# Altium schematic sheet usb_usb2534.SchDoc
size B
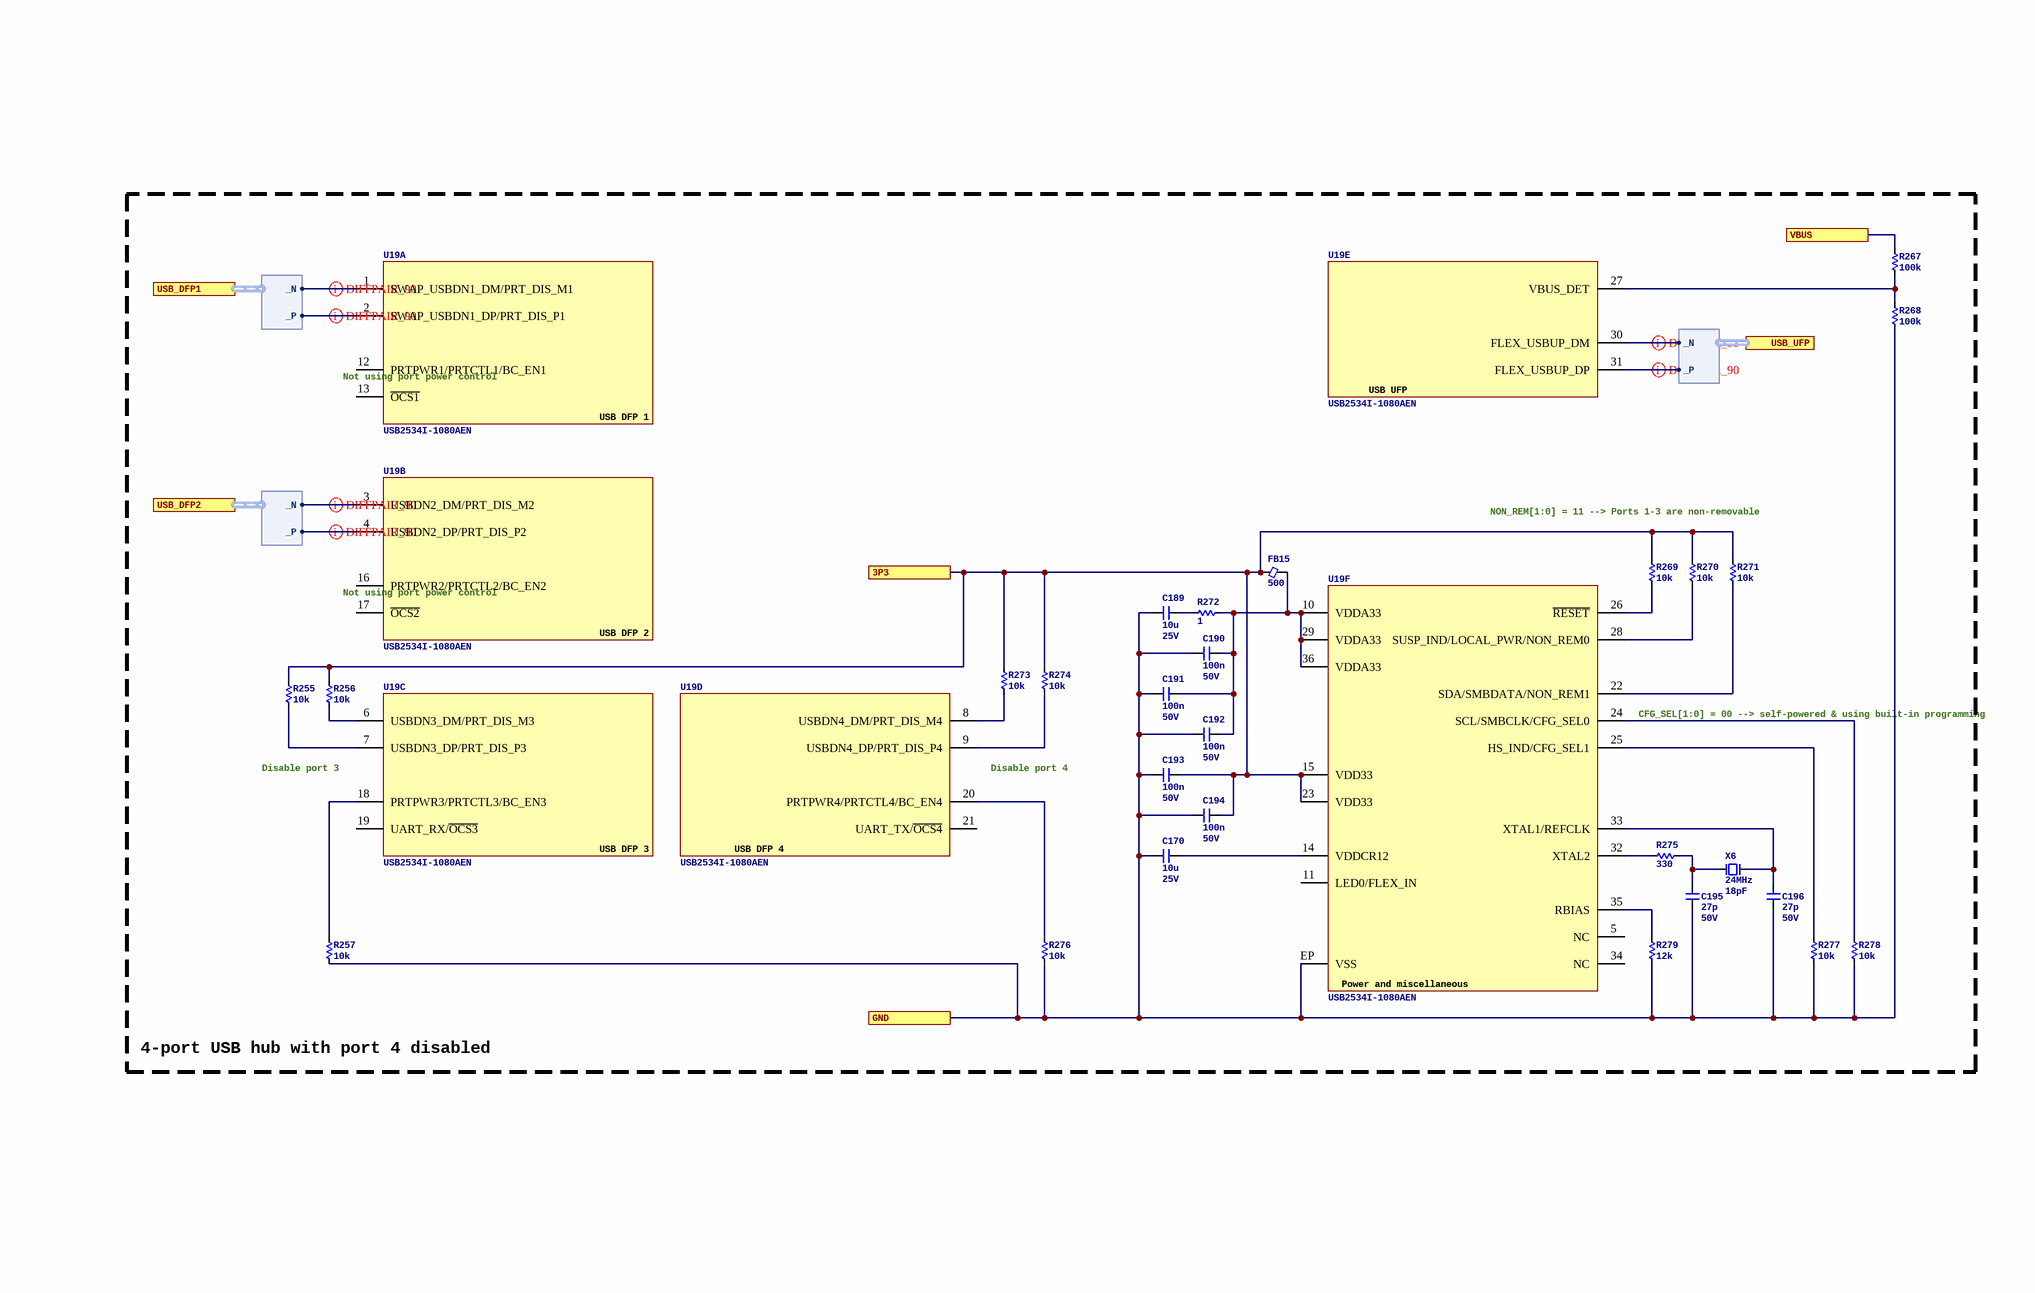
[diagram p0: usb_usb2534.SchDoc]

## Parts
C170  Capacitance: 10u  Voltage Rating: 25V  [C0603]  (hidden comment: CL10A106MA8NRNC)
C189  Capacitance: 10u  Voltage Rating: 25V  [C0805]  (hidden comment: CL21B106KAYQNNE)
C190  Capacitance: 100n  Voltage Rating: 50V  [C0402]  (hidden comment: CL05B104KB54PNC)
C191  Capacitance: 100n  Voltage Rating: 50V  [C0402]  (hidden comment: CL05B104KB54PNC)
C192  Capacitance: 100n  Voltage Rating: 50V  [C0402]  (hidden comment: CL05B104KB54PNC)
C193  Capacitance: 100n  Voltage Rating: 50V  [C0402]  (hidden comment: CL05B104KB54PNC)
C194  Capacitance: 100n  Voltage Rating: 50V  [C0402]  (hidden comment: CL05B104KB54PNC)
C195  Capacitance: 27p  Voltage Rating: 50V  [C0402]  (hidden comment: 0402CG270J500NT)
C196  Capacitance: 27p  Voltage Rating: 50V  [C0402]  (hidden comment: 0402CG270J500NT)
FB15  Current Rating (mA): 500  [FB0402]  (hidden comment: BLM15AX601SN1D)
R255  value 10k  [R0402]  (hidden comment: 0402WGF1002TCE)
R256  value 10k  [R0402]  (hidden comment: 0402WGF1002TCE)
R257  value 10k  [R0402]  (hidden comment: 0402WGF1002TCE)
R267  value 100k  [R0402]  (hidden comment: 0402WGF1003TCE)
R268  value 100k  [R0402]  (hidden comment: 0402WGF1003TCE)
R269  value 10k  [R0402]  (hidden comment: 0402WGF1002TCE)
R270  value 10k  [R0402]  (hidden comment: 0402WGF1002TCE)
R271  value 10k  [R0402]  (hidden comment: 0402WGF1002TCE)
R272  value 1  [R0402]  (hidden comment: CRCW04021R00FKED)
R273  value 10k  [R0402]  (hidden comment: 0402WGF1002TCE)
R274  value 10k  [R0402]  (hidden comment: 0402WGF1002TCE)
R275  value 330  [R0402]  (hidden comment: 0402WGF3300TCE)
R276  value 10k  [R0402]  (hidden comment: 0402WGF1002TCE)
R277  value 10k  [R0402]  (hidden comment: 0402WGF1002TCE)
R278  value 10k  [R0402]  (hidden comment: 0402WGF1002TCE)
R279  value 12k  [R0402]  (hidden comment: 0402WGF1202TCE)
U19  USB2534I-1080AEN  [QFN50P600X600X90-36N]  (parts A,B,C,D,E,F of 6)
X6  Frequency: 24MHz  Load Capacitance: 18pF  [XTAL_TXC_7A]  (hidden comment: 7A-24.000MAAJ-T)

## Ports
3P3, GND, USB_DFP1 (harness DIFF), USB_DFP2 (harness DIFF), USB_UFP (harness DIFF), VBUS

## Harnesses
DIFF: _N, _P

## Nets
3P3: C193.1 C194.1 FB15.1 R255.1 R256.1 R269.1 R270.1 R271.1 R273.1 R274.1 U19.15(VDD33) U19.23(VDD33) ; port 3P3
GND: C170.2 C189.2 C190.2 C191.2 C192.2 C193.2 C194.2 C195.2 C196.2 R257.2 R268.1 R276.2 R277.2 R278.2 R279.2 U19.EP(VSS) ; port GND
VBUS: R267.1 ; port VBUS
NetC170_1: C170.1 U19.14(VDDCR12)
NetC189_1: C189.1 R272.2
NetC190_1: C190.1 C191.1 C192.1 FB15.2 R272.1 U19.10(VDDA33) U19.29(VDDA33) U19.36(VDDA33)
NetC195_1: C195.1 R275.1 X6.1
NetC196_1: C196.1 U19.33(XTAL1/REFCLK) X6.2
NetR255_2: R255.2 U19.7(USBDN3_DP/PRT_DIS_P3)
NetR256_2: R256.2 U19.6(USBDN3_DM/PRT_DIS_M3)
NetR257_1: R257.1 U19.18(PRTPWR3/PRTCTL3/BC_EN3)
NetR267_2: R267.2 R268.2 U19.27(VBUS_DET)
NetR269_2: R269.2 U19.26(~{RESET})
NetR270_2: R270.2 U19.28(SUSP_IND/LOCAL_PWR/NON_REM0)
NetR271_2: R271.2 U19.22(SDA/SMBDATA/NON_REM1)
NetR273_2: R273.2 U19.8(USBDN4_DM/PRT_DIS_M4)
NetR274_2: R274.2 U19.9(USBDN4_DP/PRT_DIS_P4)
NetR275_2: R275.2 U19.32(XTAL2)
NetR276_1: R276.1 U19.20(PRTPWR4/PRTCTL4/BC_EN4)
NetR277_1: R277.1 U19.25(HS_IND/CFG_SEL1)
NetR278_1: R278.1 U19.24(SCL/SMBCLK/CFG_SEL0)
NetR279_1: R279.1 U19.35(RBIAS)
NetU19_1: U19.1(SWAP_USBDN1_DM/PRT_DIS_M1) ; port USB_DFP1._N
NetU19_2: U19.2(SWAP_USBDN1_DP/PRT_DIS_P1) ; port USB_DFP1._P
NetU19_3: U19.3(USBDN2_DM/PRT_DIS_M2) ; port USB_DFP2._N
NetU19_4: U19.4(USBDN2_DP/PRT_DIS_P2) ; port USB_DFP2._P
NetU19_30: U19.30(FLEX_USBUP_DM) ; port USB_UFP._N
NetU19_31: U19.31(FLEX_USBUP_DP) ; port USB_UFP._P

Not connected (* = marked no-connect by the designer): U19 5(NC) 11(LED0/FLEX_IN) 12(PRTPWR1/PRTCTL1/BC_EN1) 13(~{OCS1}) 16(PRTPWR2/PRTCTL2/BC_EN2) 17(~{OCS2}) 19(UART_RX/~{OCS3}) 21(UART_TX/~{OCS4}) 34(NC)

## Layout directives
differential pair; differential pair class DE_90: NetU19_1, NetU19_2, NetU19_3, NetU19_4, NetU19_30, NetU19_31

## Notes on the sheet
- (near U19) Not using port power control
- NON_REM[1:0] = 11 --> Ports 1-3 are non-removable
- Disable port 3
- (near U19) Disable port 4
- (near U19) CFG_SEL[1:0] = 00 --> self-powered & using built-in programming
- 4-port USB hub with port 4 disabled
- (in symbol USB_HUB_4PORT_USB2534I-1080AEN, part A) USB DFP 1
- (in symbol USB_HUB_4PORT_USB2534I-1080AEN, part B) USB DFP 2
- (in symbol USB_HUB_4PORT_USB2534I-1080AEN, part C) USB DFP 3
- (in symbol USB_HUB_4PORT_USB2534I-1080AEN, part D) USB DFP 4
- (in symbol USB_HUB_4PORT_USB2534I-1080AEN, part E) USB UFP
- (in symbol USB_HUB_4PORT_USB2534I-1080AEN, part F) Power and miscellaneous

## Library data of the parts
C170 = CL10A106MA8NRNC: Manufacturer: Samsung Electro-Mechanics; Dielectric: X5R; ComponentLink1URL: https://wmsc.lcsc.com/wmsc/upload/file/pdf/v2/lcsc/2304140030_Samsung-Electro-Mechanics-CL10A106MA8NRNC_C96446.pdf; ComponentLink1Description: Datasheet; Manufacturer Part Number: CL10A106MA8NRNC; Package: 0603; Supplier 2: LCSC; Supplier Part Number 2: C96446
C189 = CL21B106KAYQNNE: Manufacturer: Samsung Electro-Mechanics; Dielectric: X7R; ComponentLink1URL: https://datasheet.lcsc.com/lcsc/2206222030_Samsung-Electro-Mechanics-CL21B106KAYQNNE_C3039694.pdf; ComponentLink1Description: Datasheet; Manufacturer Part Number: CL21B106KAYQNNE; Package: 0805; Supplier 2: LCSC; Supplier Part Number 2: C3039694
C190-C194 = CL05B104KB54PNC: Manufacturer: Samsung Electro-Mechanics; Dielectric: X7R; ComponentLink1URL: https://wmsc.lcsc.com/wmsc/upload/file/pdf/v2/lcsc/2304140030_Samsung-Electro-Mechanics-CL05B104KB54PNC_C307331.pdf; ComponentLink1Description: Datasheet; Manufacturer Part Number: CL05B104KB54PNC; Package: 0402; Supplier 2: LCSC; Supplier Part Number 2: C307331
C195 C196 = 0402CG270J500NT: Manufacturer: FH(Guangdong Fenghua Advanced Tech); Dielectric: C0G; ComponentLink1URL: https://wmsc.lcsc.com/wmsc/upload/file/pdf/v2/lcsc/2304140030_FH--Guangdong-Fenghua-Advanced-Tech-0402CG270J500NT_C1557.pdf; ComponentLink1Description: Datasheet; Manufacturer Part Number: 0402CG270J500NT; Package: 0402; Supplier 2: LCSC; Supplier Part Number 2: C1557
FB15 = BLM15AX601SN1D: Manufacturer: Murata Electronics; Z @ 100 MHz: 600; DCR (mOhms): 340; ComponentLink1URL: https://wmsc.lcsc.com/wmsc/upload/file/pdf/v2/lcsc/2304140030_Murata-Electronics-BLM15AX601SN1D_C76886.pdf; ComponentLink1Description: Datasheet; Manufacturer Part Number: BLM15AX601SN1D; Supplier 2: LCSC; Supplier Part Number 2: C76886; Package: 0402
R255-R257 R269-R271 R273 R274 R276-R278 = 0402WGF1002TCE: Manufacturer: UNI-ROYAL(Uniroyal Elec); Tolerance: 1%; Temperature Coefficient: Â±100ppm/â„ƒ; Power Rating (mW): 62.5; ComponentLink1Description: Datasheet; ComponentLink1URL: https://wmsc.lcsc.com/wmsc/upload/file/pdf/v2/lcsc/2206010100_UNI-ROYAL-Uniroyal-Elec-0402WGF1002TCE_C25744.pdf; Manufacturer Part Number: 0402WGF1002TCE; Package: 0402; Supplier 2: LCSC; Supplier Part Number 2: C25744
R267 R268 = 0402WGF1003TCE: Manufacturer: UNI-ROYAL(Uniroyal Elec); Tolerance: 1%; Temperature Coefficient: Â±100ppm/â„ƒ; Power Rating (mW): 62.5; ComponentLink1Description: Datasheet; ComponentLink1URL: https://wmsc.lcsc.com/wmsc/upload/file/pdf/v2/lcsc/2206010100_UNI-ROYAL-Uniroyal-Elec-0402WGF1003TCE_C25741.pdf; Manufacturer Part Number: 0402WGF1003TCE; Package: 0402; Supplier 2: LCSC; Supplier Part Number 2: C25741
R272 = CRCW04021R00FKED: Manufacturer: Vishay Intertech; Tolerance: 1%; Temperature Coefficient: Â±100ppm/â„ƒ; Power Rating (mW): 63; ComponentLink1Description: Datasheet; ComponentLink1URL: https://wmsc.lcsc.com/wmsc/upload/file/pdf/v2/lcsc/2211030200_Vishay-Intertech-CRCW04021R00FKED_C482087.pdf; Manufacturer Part Number: CRCW04021R00FKED; Package: 0402; Supplier 2: LCSC; Supplier Part Number 2: C482087
R275 = 0402WGF3300TCE: Manufacturer: UNI-ROYAL(Uniroyal Elec); Tolerance: 1%; Temperature Coefficient: Â±100ppm/â„ƒ; Power Rating (mW): 62.5; ComponentLink1Description: Datasheet; ComponentLink1URL: https://wmsc.lcsc.com/wmsc/upload/file/pdf/v2/lcsc/2205311900_UNI-ROYAL-Uniroyal-Elec-0402WGF3300TCE_C25104.pdf; Manufacturer Part Number: 0402WGF3300TCE; Package: 0402; Supplier 2: LCSC; Supplier Part Number 2: C25104
R279 = 0402WGF1202TCE: Manufacturer: UNI-ROYAL(Uniroyal Elec); Tolerance: 1%; Temperature Coefficient: Â±100ppm/â„ƒ; Power Rating (mW): 62.5; ComponentLink1Description: Datasheet; ComponentLink1URL: https://wmsc.lcsc.com/wmsc/upload/file/pdf/v2/lcsc/2411221127_UNI-ROYAL-Uniroyal-Elec-0402WGF1202TCE_C25752.pdf; Manufacturer Part Number: 0402WGF1202TCE; Package: 0402; Supplier 2: LCSC; Supplier Part Number 2: C25752
U19 = USB_HUB_4PORT_USB2534I-1080AEN: USB Bus Controller, CMOS; Manufacturer: Microchip; Supplier 1: Digikey; Supplier Part Number 1: USB2534I-1080AEN-ND; Manufacturer Part Number: USB2534I-1080AEN; ComponentLink1Description: Datasheet; ComponentLink1URL: https://ww1.microchip.com/downloads/aemDocuments/documents/UNG/ProductDocuments/DataSheets/USB2534-Data-Sheet-DS00001713.pdf; ComponentLink2Description: Product page; ComponentLink2URL: https://www.microchip.com/en-us/product/USB2534; Supplier 2: LCSC; Supplier Part Number 2: C626674
X6 = XTAL_7A-24.000MAAJ-T: CRYSTAL 24.000 MHZ 18PF SMD; Manufacturer: TXC CORPORATION; Supplier 1: Digikey; ComponentLink1URL: http://www.txccrystal.com/images/pdf/7a.pdf; ComponentLink1Description: Datasheet; Supplier Part Number 1: 887-1090-1-ND; Manufacturer Part Number: 7A-24.000MAAJ-T; Supplier 2: LCSC; Supplier Part Number 2: C2450230